# EAGLE design IR_sensor (EAGLE 9.6.2)
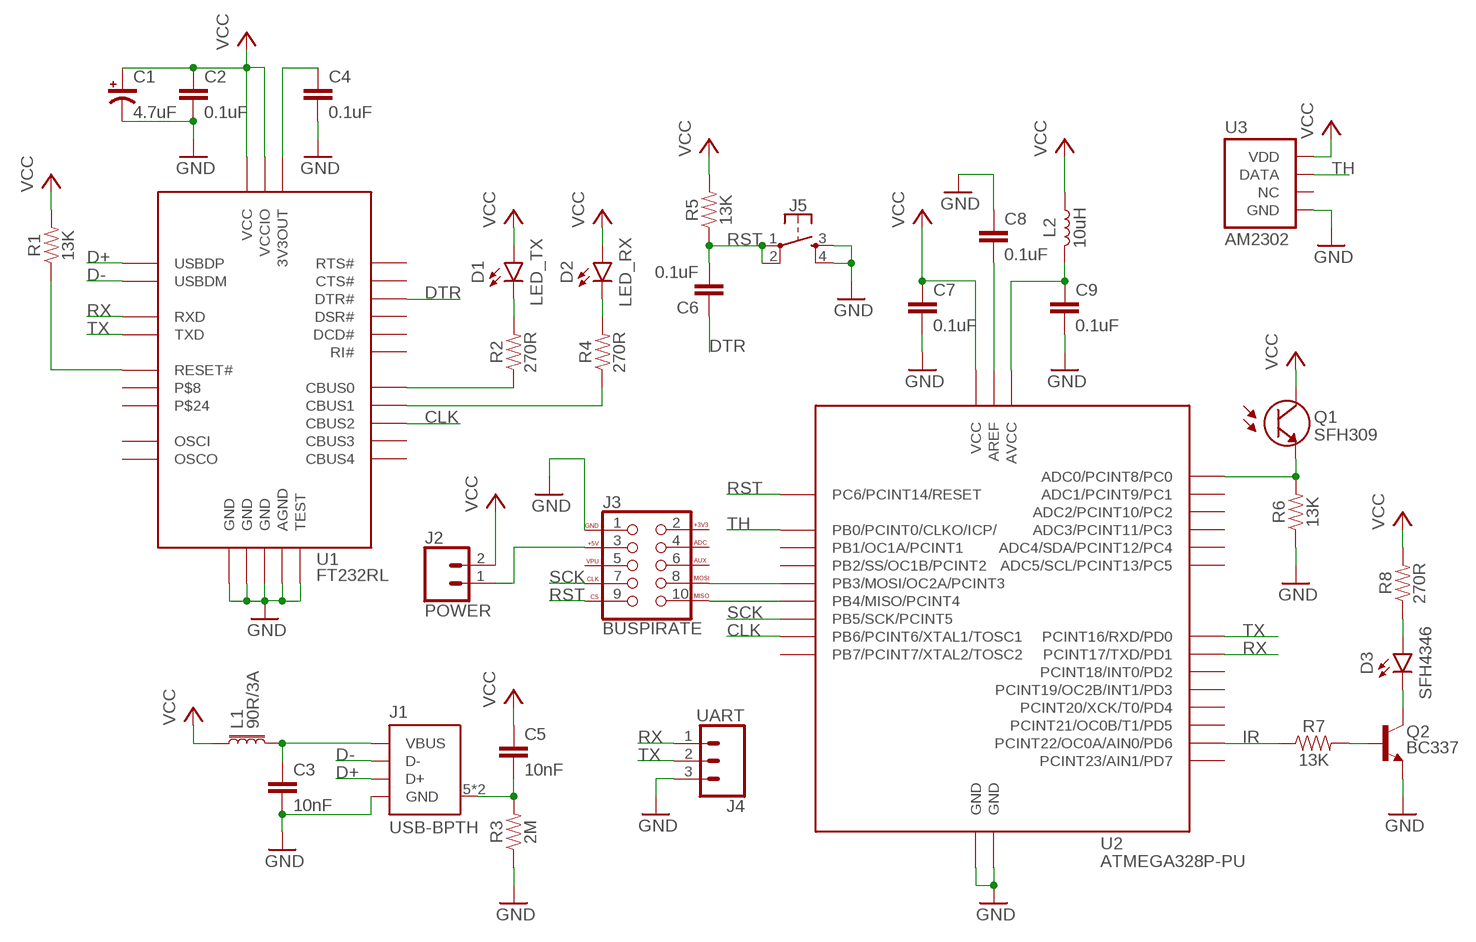
[diagram p0: schematic, sheet 1]

## Parts
C1  4.7uF  CAP-POL  [CPOL-RADIAL-2.5MM-5MM]
C2  0.1uF  CAPPTH-5MM  [CAP-PTH-5MM]
C3  10nF  CAPPTH2.5MM  [CAP-PTH-2.5MM]
C4  0.1uF  CAPPTH-5MM  [CAP-PTH-5MM]
C5  10nF  CAPPTH-5MM  [CAP-PTH-5MM]
C6  0.1uF  CAPPTH-5MM  [CAP-PTH-5MM]
C7  0.1uF  CAPPTH-5MM  [CAP-PTH-5MM]
C8  0.1uF  CAPPTH-5MM  [CAP-PTH-5MM]
C9  0.1uF  CAPPTH-5MM  [CAP-PTH-5MM]
D1  LED_TX  LEDPTH-5MM  [LED_5MM]
D2  LED_RX  LEDPTH-5MM  [LED_5MM]
D3  SFH4346  LEDR-3MM  [LED_3MM_R]
J1  USB-BPTH  [USB-B-PTH]
J2  POWER  CONN_02  [1X02]
J3  BUSPIRATE  ICSPPTH  [2X5-SHROUDED]
J4  UART  CONN_03  [1X03]
J5  SWITCH  [TACTILE_SWITCH_PTH_6.0MM]
L1  90R/3A  FERRITE_BEADPTH  [AXIAL-0.3]
L2  10uH  INDUCTORPTH  [AXIAL-0.4]
Q1  SFH309  PHOTOTRANSISTORPTH-R  [LED_3MM_R]
Q2  BC337  NPNPTH  [TO-92]
R1  13K  RESISTORPTH  [AXIAL-0.3]
R2  270R  RESISTORPTH  [AXIAL-0.3]
R3  2M  RESISTORPTH  [AXIAL-0.3]
R4  270R  RESISTORPTH  [AXIAL-0.3]
R5  13K  RESISTORPTH  [AXIAL-0.3]
R6  13K  RESISTORPTH  [AXIAL-0.3]
R7  13K  RESISTORPTH  [AXIAL-0.3]
R8  270R  RESISTORPTH  [AXIAL-0.3]
U1  FT232RL  [TSSOP-28-BL]
U2  ATMEGA328P-PU  [DIP28]
U3  AM2302  [SNR4-2.54]

## Nets
ADC: Q1.A(E) R6.P$2 U2.23(ADC0/PCINT8/PC0)
CLK: U1.13(CBUS2) U2.9(PB6/PCINT6/XTAL1/TOSC1)
D+: J1.3(D+) U1.15(USBDP)
D-: J1.2(D-) U1.16(USBDM)
DTR: C6.1 U1.2(DTR#)
GND: C1.2(-) C2.2 C3.2 C4.2 C7.2 C8.1 C9.2 J1.4(GND) J3.1(GND) J4.3 J5.3 J5.4 Q2.1(E) R3.P$1 R6.P$1 U1.7(GND) U1.18(GND) U1.21(GND) U1.25(AGND) U1.26(TEST) U2.8(GND) U2.22(GND) U3.P$4(GND)
IR: R7.P$1 U2.12(PCINT22/OC0A/AIN0/PD6)
MISO: J3.10(MISO) U2.18(PB4/MISO/PCINT4)
MOSI: J3.8(MOSI) U2.17(PB3/MOSI/OC2A/PCINT3)
N$1: C3.1 J1.1(VBUS) L1.P$2
N$2: R1.P$1 U1.19(RESET#)
N$3: C4.1 U1.17(3V3OUT)
N$4: D1.K R2.P$2
N$5: C8.2 U2.21(AREF)
N$6: D2.K R4.P$2
N$7: J2.1 J3.3(+5V)
N$8: D3.K Q2.3(C)
N$9: R2.P$1 U1.23(CBUS0)
N$10: C5.2 J1.5(SHIELD) J1.6(SHIELD) R3.P$2
N$11: D3.A R8.P$1
N$12: Q2.2(B) R7.P$2
N$13: C9.1 L2.P$2 U2.20(AVCC)
N$15: R4.P$1 U1.22(CBUS1)
RST: C6.2 J3.9(CS) J5.1 J5.2 R5.P$1 U2.1(PC6/PCINT14/RESET)
RX: J4.1 U1.5(RXD) U2.3(PCINT17/TXD/PD1)
SCK: J3.7(CLK) U2.19(PB5/SCK/PCINT5)
TH: U2.14(PB0/PCINT0/CLKO/ICP/) U3.P$2(DATA)
TX: J4.2 U1.1(TXD) U2.2(PCINT16/RXD/PD0)
VCC: C1.1(+) C2.1 C5.1 C7.1 D1.A D2.A J2.2 L1.P$1 L2.P$1 Q1.K(C) R1.P$2 R5.P$2 R8.P$2 U1.4(VCCIO) U1.20(VCC) U2.7(VCC) U3.P$1(VDD)
Unconnected: J3.4(ADC) J3.5(VPU) J3.6(AUX) U1.3(RTS#) U1.6(RI#) U1.8 U1.9(DSR#) U1.10(DCD#) U1.11(CTS#) U1.12(CBUS4) U1.14(CBUS3) U1.24 U1.27(OSCI) U1.28(OSCO) U2.4(PCINT18/INT0/PD2) U2.5(PCINT19/OC2B/INT1/PD3) U2.6(PCINT20/XCK/T0/PD4) U2.10(PB7/PCINT7/XTAL2/TOSC2) U2.11(PCINT21/OC0B/T1/PD5) U2.13(PCINT23/AIN1/PD7) U2.15(PB1/OC1A/PCINT1) U2.16(PB2/SS/OC1B/PCINT2) U2.24(ADC1/PCINT9/PC1) U2.25(ADC2/PCINT10/PC2) U2.26(ADC3/PCINT11/PC3) U2.27(ADC4/SDA/PCINT12/PC4) U2.28(ADC5/SCL/PCINT13/PC5) U3.P$3(NC)

## Power pins joined to a net without a drawn wire
+3V3: J3.2(+3V3)

## Library data of the parts
C1 = CUSTOM_COMPONENTS:CAP-POL
C2-C9 = CUSTOM_COMPONENTS:CAP
D1-D3 = CUSTOM_COMPONENTS:LED
J1 = CUSTOM_COMPONENTS:USB-B
J2 = CUSTOM_COMPONENTS:CONN_02
J3 = CUSTOM_COMPONENTS:ICSP: Buspirate 10-pin ICSP Header available at Seeed Studio
J4 = CUSTOM_COMPONENTS:CONN_03: Multi connection point. Often used as Generic Header-pin footprint for 0.1 inch spaced/style header connections On any of the 0.1 inch spaced packages, you can populate with these: Break Away Headers - Straight <https://www.sparkfun.com/products/116> (PRT-00116) Break Away Male Headers - Right Angle <https://www.sparkfun.com/products/553> (PRT-00553) Female Headers <https://www.sparkfun.com/products/115> (PRT-00115) Break Away Headers - Machine Pin <https://www.sparkfun.com/products/117> (PRT-00117) Break Away Female Headers - Swiss Machine Pin <https://www.sparkfun.com/products/743> (PRT-00743) Stackable Header - 3 Pin (Female, 0.1") <https://www.sparkfun.com/products/13875> (PRT-13875) For SCREWTERMINALS and SPRING TERMINALS visit here: Screw Terimnals on SparkFun.com <https://www.sparkfun.com/search/results?term=Screw+Terminals> (5mm/3.5mm/2.54mm spacing) This device is also useful as a general connection point to wire up your design to another part of your project. Our various solder wires solder well into these plated through hole pads. Hook-Up Wire - Assortment (Stranded, 22 AWG) <https://www.sparkfun.com/products/11375> (PRT-11375) Hook-Up Wire - Assortment (Solid Core, 22 AWG) <https://www.sparkfun.com/products/11367> (PRT-11367) View the entire wire category on our website here <https://www.sparkfun.com/categories/141> Special notes: Molex polarized connector foot print use with SKU : PRT-08232 with associated crimp pins and housings.
J5 = CUSTOM_COMPONENTS:SWITCH
L1 = CUSTOM_COMPONENTS:FERRITE_BEAD
L2 = CUSTOM_COMPONENTS:INDUCTOR
Q1 = CUSTOM_COMPONENTS:PHOTOTRANSISTOR: Check prices <https://pricing.snapeda.com/parts/BPW85/Vishay/view-part?ref=eda>
Q2 = CUSTOM_COMPONENTS:NPN
R1-R8 = CUSTOM_COMPONENTS:RESISTOR
U1 = CUSTOM_COMPONENTS:FT232RL
U2 = CUSTOM_COMPONENTS:ATMEGA328P-PU
U3 = CUSTOM_COMPONENTS:AM2302: 314010001

## Board
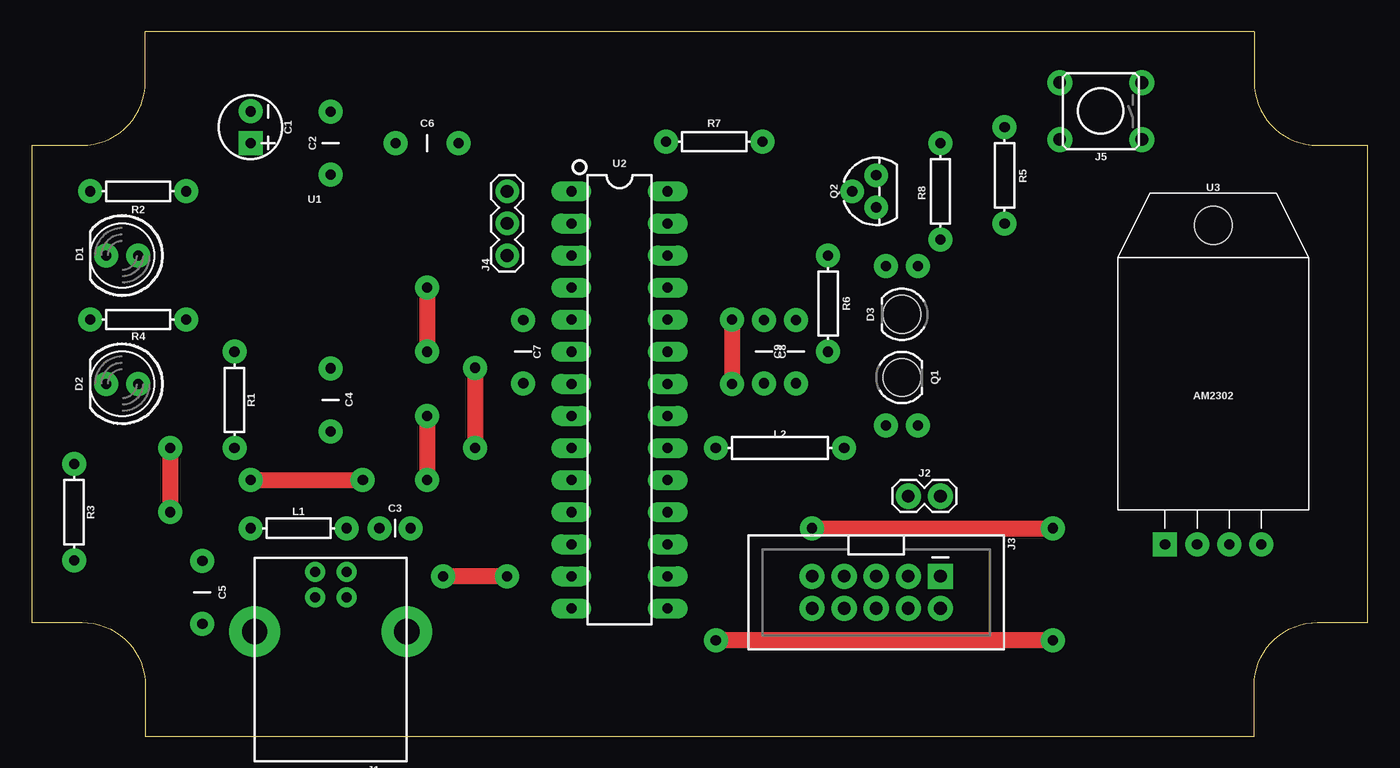
[diagram p1: board, top side]
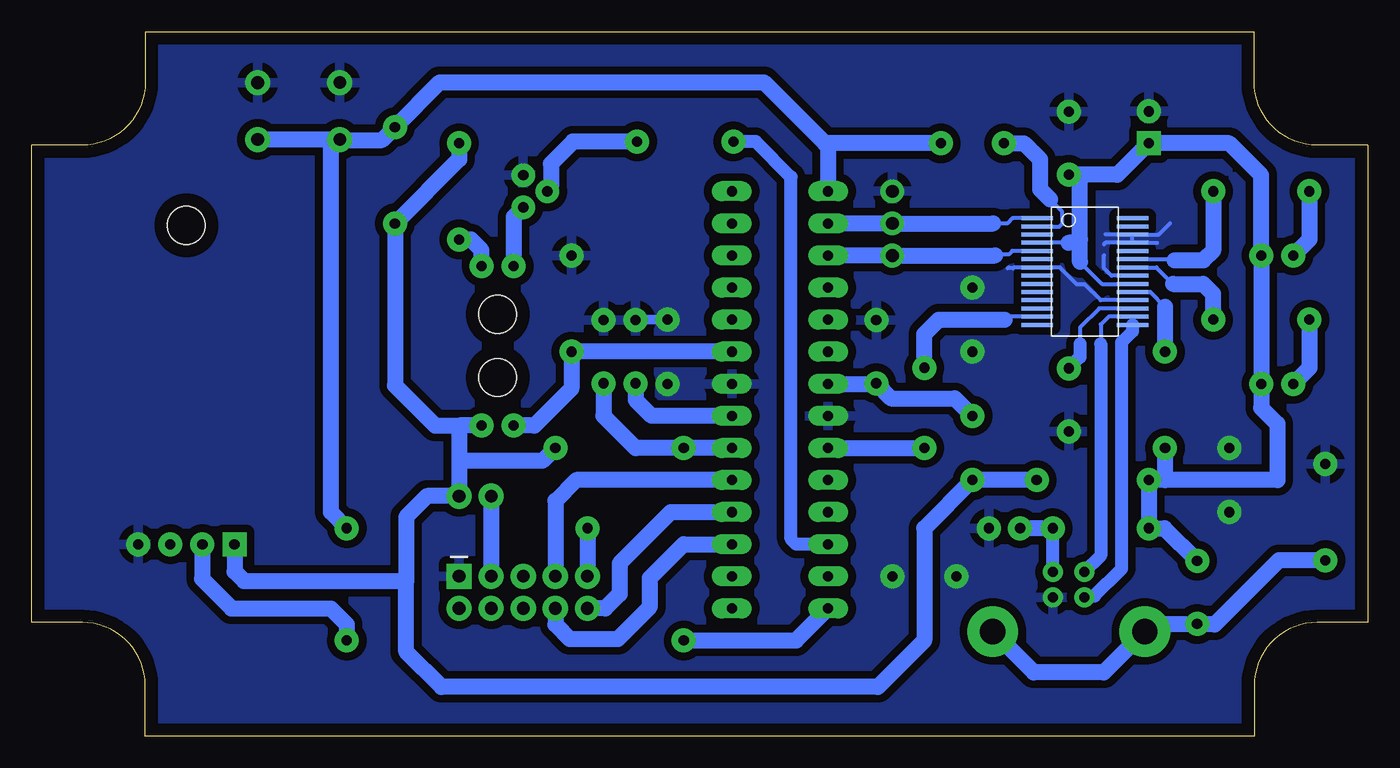
[diagram p2: board, bottom side, seen from below]

Size 105.78 x 55.78 mm. Coordinates in mm from the lower left corner, seen from the top.
Outline: 0,46.78 0,9 4,9 arc-90 9,4 9,0 96.78,0 96.78,4 arc-90 101.78,9 105.78,9 105.78,46.78 101.78,46.78 arc-90 96.78,51.78 96.78,55.78 9,55.78 9,51.78 arc-90 4,46.78 0,46.78
Copper layers (1*16): Top 0.035mm / dielectric 1.5mm / Bottom 0.035mm
Design rules "smd *": minimum track width 10mil, minimum drill 0.35mm, track to track 24mil, track to pad 24mil, pad to pad 12mil, via to via 24mil, smd to smd 10mil, copper to edge 40mil, drill to drill 24mil, minimum pad ring 10mil, minimum via ring 8mil, stop-mask expansion 4mil, vias tented up to drill 0mil, thermal gap 24mil

### Footprints (pad centres in the part's own frame; a part is rotated, then mirrored left to right if it is on the bottom)
CPOL-RADIAL-2.5MM-5MM = drill 0.8 pad 1.9 square: 1 1.25,0 | drill 0.8 pad 1.9: 2 -1.25,0
CAP-PTH-5MM = drill 0.8 pad 1.9: 1 -2.5,0; 2 2.5,0
CAP-PTH-2.5MM = drill 0.8 pad 1.9: 1 -1.23,0; 2 1.23,0
LED_5MM = drill 0.8 pad 1.9: A -1.27,0; K 1.27,0
LED_3MM_R = drill 0.8 pad 1.9: A -1.27,-3.81; K 1.27,-3.81 | hole 3: 0,0
USB-B-PTH = drill 0.8 pad 1.575: 1 1.25,14.99; 2 -1.25,14.99; 3 -1.25,12.99; 4 1.25,12.99 | drill 2 pad 4: 5 -6.02,10.28; 6 6.02,10.28
1X02 = drill 1 pad 2: 1 0,0; 2 2.54,0
2X5-SHROUDED = drill 1 pad 2 square: 1 -1.27,5.08 | drill 1 pad 2: 2 1.27,5.08; 3 -1.27,2.54; 4 1.27,2.54; 5 -1.27,0; 6 1.27,0; 7 -1.27,-2.54; 8 1.27,-2.54; 9 -1.27,-5.08; 10 1.27,-5.08
1X03 = drill 1.016 pad 1.88: 1 0,0; 2 2.54,0; 3 5.08,0
TACTILE_SWITCH_PTH_6.0MM = drill 1 pad 2: 1 -3.25,2.25; 2 3.25,2.25; 3 -3.25,-2.25; 4 3.251,-2.261
AXIAL-0.3 = drill 0.8 pad 1.9: P$1 -3.81,0; P$2 3.81,0
AXIAL-0.4 = drill 0.8 pad 1.9: P$1 -5.08,0; P$2 5.08,0
TO-92 = drill 0.8 pad 1.88: 1 1.27,0; 2 0,1.905; 3 -1.27,0
TSSOP-28-BL = smd 2.5 x 0.32 bottom: 1 3.775,4.225; 2 3.775,3.575; 3 3.775,2.925; 4 3.775,2.275; 5 3.775,1.625; 6 3.775,0.975; 7 3.775,0.325; 8 3.775,-0.325; 9 3.775,-0.975; 10 3.775,-1.625; 11 3.775,-2.275; 12 3.775,-2.925; 13 3.775,-3.575; 14 3.775,-4.225; 15 -3.775,-4.225; 16 -3.775,-3.575; 17 -3.775,-2.925; 18 -3.775,-2.275; 19 -3.775,-1.625; 20 -3.775,-0.975; 21 -3.775,-0.325; 22 -3.775,0.325; 23 -3.775,0.975; 24 -3.775,1.625; 25 -3.775,2.275; 26 -3.775,2.925; 27 -3.775,3.575; 28 -3.775,4.225
DIP28 = drill 0.8 pad 1.6 long: 1 -16.51,-3.81; 2 -13.97,-3.81; 3 -11.43,-3.81; 4 -8.89,-3.81; 5 -6.35,-3.81; 6 -3.81,-3.81; 7 -1.27,-3.81; 8 1.27,-3.81; 9 3.81,-3.81; 10 6.35,-3.81; 11 8.89,-3.81; 12 11.43,-3.81; 13 13.97,-3.81; 14 16.51,-3.81; 15 16.51,3.81; 16 13.97,3.81; 17 11.43,3.81; 18 8.89,3.81; 19 6.35,3.81; 20 3.81,3.81; 21 1.27,3.81; 22 -1.27,3.81; 23 -3.81,3.81; 24 -6.35,3.81; 25 -8.89,3.81; 26 -11.43,3.81; 27 -13.97,3.81; 28 -16.51,3.81
SNR4-2.54 = drill 0.8 pad 1.9 square: P$1 -3.81,-12.7 | drill 0.8 pad 1.9: P$2 -1.27,-12.7; P$3 1.27,-12.7; P$4 3.81,-12.7 | hole 3: 0,12.55

### Placement (x,y rotation side)
C1  17.33,48.21 270 top
C2  23.68,46.94 90 top
C3  28.76,16.46 0 top
C4  23.68,26.62 270 top
C5  13.52,11.38 270 top
C6  31.3,46.94 0 top
C7  38.92,30.43 90 top
C8  57.97,30.43 270 top
C9  60.51,30.43 90 top
D1  7.17,38.05 180 top
D2  7.17,27.89 180 top
D3  68.89,33.39 180 top
J1  23.68,-2 0 top
J2  69.4,19 0 top
J3  66.86,11.38 270 top
J4  37.65,38.05 90 top
J5  84.64,49.48 180 top
L1  21.14,16.46 0 top
L2  59.24,22.81 180 top
Q1  68.89,28.39 0 top
Q2  66.86,43.13 90 top
R1  16.06,26.62 270 top
R2  8.44,43.13 180 top
R3  3.36,17.73 270 top
R4  8.44,32.97 180 top
R5  77.02,44.4 270 top
R6  63.05,34.24 270 top
R7  54.03,47.07 0 top
R8  71.94,43.13 90 top
U1  22.41,36.78 0 top
U2  46.54,26.62 270 top
U3  93.53,27.89 0 top

### Tracks (layer width: path | path; a pad name or v marks a point on that pad's centre or on a via)
ADC
  Bottom 1.27: Q1.A 65.98,24.58 63.05,27.51 R6.P$2 U2.23
CLK  (via drill 0.8 pad 1.9)
  Top 1.27: v35.11,29.16 v35.11,22.81
  Bottom 0.305: U1.13 28.53,33.2 28.76,32.97
  Bottom 1.27: U2.9 v35.11,22.81 | v35.11,29.16 35.11,31.83 33.97,32.97 28.76,32.97
D+
  Bottom 1.016: J1.3 22.34,11.09 21.64,11.09 19.49,13.24 19.49,31.19 18.63,32.05 arc0 U1.15
D-
  Bottom 0.305: U1.16 20.52,33.2 21.14,32.59 21.14,31.07
  Bottom 1.016: J1.2 21.14,14.28 21.14,31.07
DTR
  Bottom 0.305: U1.2 26.17,40.34 24.44,40.34 24.19,40.59 24.19,41.52 25.14,42.48
  Bottom 1.27: C6.1 27.24,46.94 25.97,45.67 25.97,43.3 25.14,42.48
GND  (via drill 0.8 pad 1.9)
  Top 1.27: v55.43,32.97 v55.43,27.89 | v37.65,12.65 v32.57,12.65 | v10.98,22.81 v10.98,17.73 | v31.3,35.51 v31.3,30.43
  Bottom 0.305: U1.25 U1.26 | U1.26 20.76,39.7 | U1.25 20.77,39.05 20.89,38.94 | U1.21 20.31,36.45 20.89,37.03 20.89,38.05 | 28.02,37.11 U1.7 24.39,37.11 23.05,35.76 22.41,35.76 21.15,34.51 U1.18 | 28.02,37.11 28.44,37.11 28.51,37.03 28.09,37.03 28.02,37.11 | U1.26 16.56,39.7 15.68,40.59 | U1.25 16.68,39.05
  Bottom 0.61: 57.93,32.97 C8.1
  Bottom 0.762: v55.43,32.97 57.93,32.97
  pour Bottom: 0,55.78 105.78,55.78 105.78,0 0,0
IR
  Bottom 1.016: U2.12 45.27,15.19 45.65,15.57 45.65,44.27 48.45,47.07 R7.P$1
MISO
  Bottom 1.27: U2.18 55.18,17.73 59.24,13.67 59.24,11.25 60.38,10.11 J3.10
MOSI
  Bottom 1.27: U2.17 54.16,15.19 56.83,12.52 56.83,10.24 59.37,7.7 63.18,7.7 64.32,8.84 J3.8
N$1
  Bottom 1.016: J1.1 24.93,16.44 L1.P$2
  Bottom 1.27: L1.P$2 C3.1
N$2
  Bottom 0.305: U1.19 17.23,35.16 16.06,33.99
  Bottom 1.27: 16.06,33.99 R1.P$1
N$3
  Bottom 0.305: U1.17 21.27,33.86 22.79,32.34 22.79,31.07
  Bottom 1.016: 22.79,31.07 22.79,30.01 C4.1
N$4
  Bottom 1.27: R2.P$2 4.63,39.32 D1.K
N$5
  Bottom 1.27: U2.21 56.7,25.35 57.97,26.62 C8.2
N$6
  Bottom 1.27: R4.P$2 4.63,29.16 D2.K
N$7
  Bottom 1.27: J2.1 J3.3
N$8
  Bottom 1.27: Q2.3 67.62,41.1 D3.K
N$9
  Bottom 0.305: U1.23 15.38,37.76 15.3,37.67
  Bottom 1.27: R2.P$1 12.25,38.43 13.01,37.67 15.3,37.67
N$10
  Bottom 1.27: J1.6 26.45,5.03 20.91,5.03 J1.5 17.1,8.84 13.56,8.84 C5.2 13.48,8.84 12.12,8.84 7.04,13.92 R3.P$2
N$11
  Bottom 1.27: R8.P$1 71.01,39.32 70.16,38.47 D3.A
N$12
  Bottom 1.27: R7.P$2 62.92,47.07 64.68,45.31 64.68,43.5 64.95,43.22 Q2.2
N$13
  Bottom 1.27: U2.20 L2.P$2 57.97,22.81 60.51,25.35 C9.1
N$15
  Bottom 0.305: U1.22 16.74,37.11 15.42,35.79
  Bottom 1.27: R4.P$1 12.25,35 13.04,35.79 15.42,35.79
RST  (via drill 0.8 pad 1.9)
  Top 1.27: v61.78,16.46 v80.83,16.46
  Bottom 1.27: v61.78,16.46 J3.9 | J5.1 J5.2 81.35,47.19 | v80.83,16.46 82.1,17.73 82.1,47.19 81.35,47.19 | 42.73,46.94 U2.1 | C6.2 42.73,46.94 | 42.73,46.94 42.98,46.94 47.81,51.77 73.46,51.77 R5.P$1 78.04,47.19 81.35,47.19
RX
  Bottom 0.305: U1.5 28.15,38.41 28.38,38.18 29.39,38.18 29.52,38.05
  Bottom 1.27: U2.3 J4.1 29.52,38.05
SCK
  Bottom 1.27: U2.19 62.67,20.27 64.32,18.62 J3.7
TH  (via drill 0.8 pad 1.9)
  Top 1.27: v80.83,7.57 v54.16,7.57
  Bottom 1.27: v54.16,7.57 45.27,7.57 U2.14 | v80.83,7.57 80.83,8.84 82.1,10.11 89.95,10.11 92.3,12.45 92.3,15.15 U3.P$2
TX
  Bottom 0.305: U1.1 28.12,41.01 28.54,40.59 29.65,40.59
  Bottom 1.27: U2.2 J4.2 29.65,40.59
VCC  (via drill 0.8 pad 1.9)
  Top 1.27: v17.33,20.27 v26.22,20.27 | v31.3,25.35 v31.3,20.27
  Bottom 0.305: U1.20 21.05,35.8 22.79,37.54 | 23.68,39.05 U1.4
  Bottom 1.27: 76.13,12.27 76.13,6.68 73.34,3.89 38.79,3.89 35.11,7.57 35.11,16.46 v31.3,20.27 v26.22,20.27 | Q1.K 71.94,24.58 | 71.94,24.58 71.94,21.79 | 71.94,21.79 J2.2 74.48,19 76.13,17.35 76.13,12.27 | L2.P$1 65.34,21.79 71.94,21.79 | U3.P$1 89.72,13.03 88.96,12.27 76.13,12.27 | 16.06,20.27 7.17,20.27 7.17,24.71 8.44,25.98 D2.A D1.A 8.44,44.4 10.98,46.94 17.31,46.94 C1.1 19.85,44.44 22.41,44.44 | 16.06,20.27 v17.33,20.27 L1.P$1 16.1,16.46 C5.1 | 71.94,24.58 73.84,24.58 77.02,27.76 R5.P$2 71.94,45.67 R8.P$2 | U2.7 38.96,27.89 C7.1 37.74,26.75 32.7,26.75 v31.3,25.35 | R1.P$2 16.06,20.27 | 22.41,44.44 C2.1 | 22.79,37.54 22.79,39.32 | 22.79,39.32 22.79,44.06 22.41,44.44 | 22.79,39.32 23.06,39.05 23.68,39.05